# Altium project led panel 0.3.PrjPcb
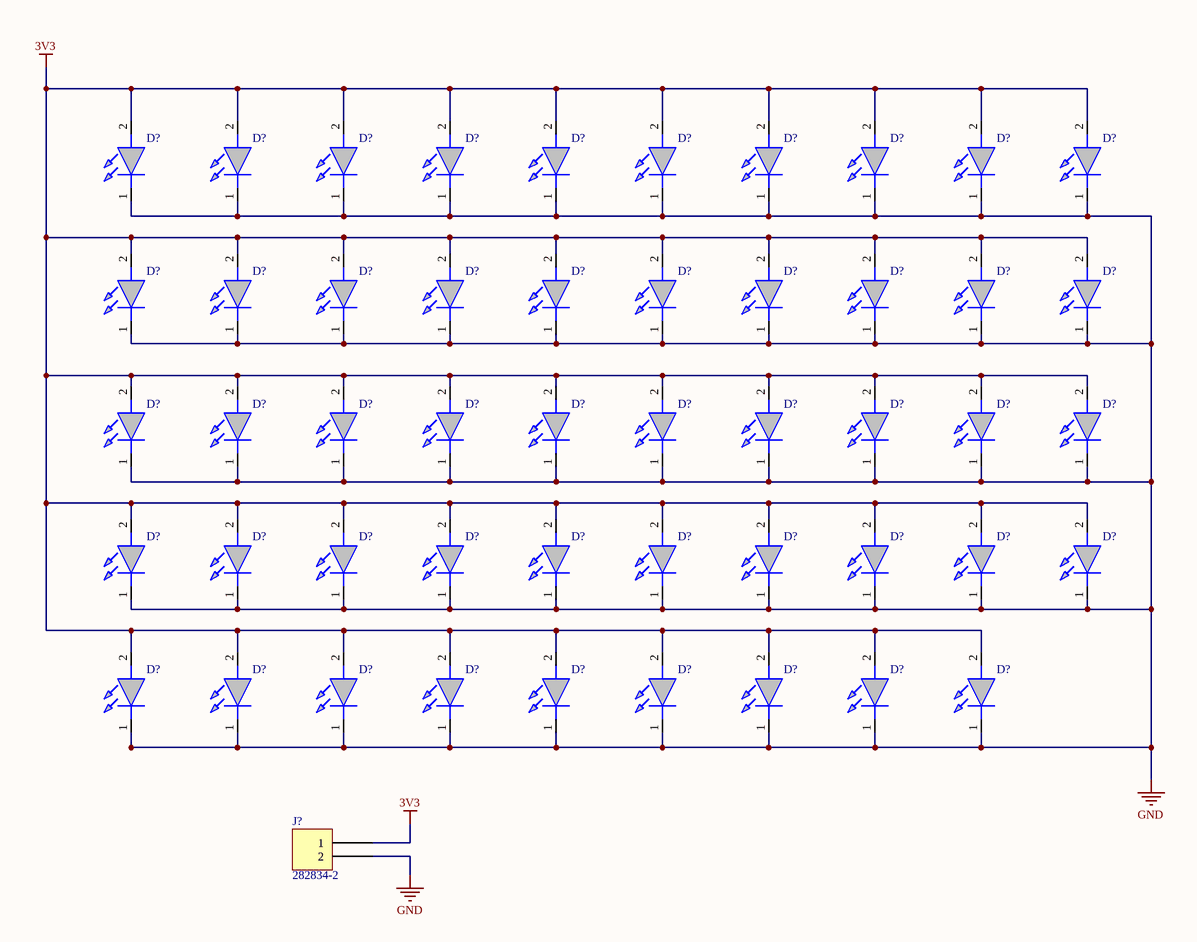
[diagram p0: led panel 0.3.SchDoc]
1 sheet, 50 parts. Net scope: global (net labels, ports and power ports of the same name join across sheets).
Board file: led panel 0.3.PcbDoc

## Sheet led panel 0.3.SchDoc
size D; SheetNumber: 1; SheetTotal: 1

### Parts
(Parts that share a designator on the sheet are numbered #1, #2 ... from top to bottom, then left to right.)
D?#1  L1IG-0750100000000  [L1IG0750100000000]  (value not drawn)
D?#2  L1IG-0750100000000  [L1IG0750100000000]  (value not drawn)
D?#3  L1IG-0750100000000  [L1IG0750100000000]  (value not drawn)
D?#4  L1IG-0750100000000  [L1IG0750100000000]  (value not drawn)
D?#5  L1IG-0750100000000  [L1IG0750100000000]  (value not drawn)
D?#6  L1IG-0750100000000  [L1IG0750100000000]  (value not drawn)
D?#7  L1IG-0750100000000  [L1IG0750100000000]  (value not drawn)
D?#8  L1IG-0750100000000  [L1IG0750100000000]  (value not drawn)
D?#9  L1IG-0750100000000  [L1IG0750100000000]  (value not drawn)
D?#10  L1IG-0750100000000  [L1IG0750100000000]  (value not drawn)
D?#11  L1IG-0750100000000  [L1IG0750100000000]  (value not drawn)
D?#12  L1IG-0750100000000  [L1IG0750100000000]  (value not drawn)
D?#13  L1IG-0750100000000  [L1IG0750100000000]  (value not drawn)
D?#14  L1IG-0750100000000  [L1IG0750100000000]  (value not drawn)
D?#15  L1IG-0750100000000  [L1IG0750100000000]  (value not drawn)
D?#16  L1IG-0750100000000  [L1IG0750100000000]  (value not drawn)
D?#17  L1IG-0750100000000  [L1IG0750100000000]  (value not drawn)
D?#18  L1IG-0750100000000  [L1IG0750100000000]  (value not drawn)
D?#19  L1IG-0750100000000  [L1IG0750100000000]  (value not drawn)
D?#20  L1IG-0750100000000  [L1IG0750100000000]  (value not drawn)
D?#21  L1IG-0750100000000  [L1IG0750100000000]  (value not drawn)
D?#22  L1IG-0750100000000  [L1IG0750100000000]  (value not drawn)
D?#23  L1IG-0750100000000  [L1IG0750100000000]  (value not drawn)
D?#24  L1IG-0750100000000  [L1IG0750100000000]  (value not drawn)
D?#25  L1IG-0750100000000  [L1IG0750100000000]  (value not drawn)
D?#26  L1IG-0750100000000  [L1IG0750100000000]  (value not drawn)
D?#27  L1IG-0750100000000  [L1IG0750100000000]  (value not drawn)
D?#28  L1IG-0750100000000  [L1IG0750100000000]  (value not drawn)
D?#29  L1IG-0750100000000  [L1IG0750100000000]  (value not drawn)
D?#30  L1IG-0750100000000  [L1IG0750100000000]  (value not drawn)
D?#31  L1IG-0750100000000  [L1IG0750100000000]  (value not drawn)
D?#32  L1IG-0750100000000  [L1IG0750100000000]  (value not drawn)
D?#33  L1IG-0750100000000  [L1IG0750100000000]  (value not drawn)
D?#34  L1IG-0750100000000  [L1IG0750100000000]  (value not drawn)
D?#35  L1IG-0750100000000  [L1IG0750100000000]  (value not drawn)
D?#36  L1IG-0750100000000  [L1IG0750100000000]  (value not drawn)
D?#37  L1IG-0750100000000  [L1IG0750100000000]  (value not drawn)
D?#38  L1IG-0750100000000  [L1IG0750100000000]  (value not drawn)
D?#39  L1IG-0750100000000  [L1IG0750100000000]  (value not drawn)
D?#40  L1IG-0750100000000  [L1IG0750100000000]  (value not drawn)
D?#41  L1IG-0750100000000  [L1IG0750100000000]  (value not drawn)
D?#42  L1IG-0750100000000  [L1IG0750100000000]  (value not drawn)
D?#43  L1IG-0750100000000  [L1IG0750100000000]  (value not drawn)
D?#44  L1IG-0750100000000  [L1IG0750100000000]  (value not drawn)
D?#45  L1IG-0750100000000  [L1IG0750100000000]  (value not drawn)
D?#46  L1IG-0750100000000  [L1IG0750100000000]  (value not drawn)
D?#47  L1IG-0750100000000  [L1IG0750100000000]  (value not drawn)
D?#48  L1IG-0750100000000  [L1IG0750100000000]  (value not drawn)
D?#49  L1IG-0750100000000  [L1IG0750100000000]  (value not drawn)
J?  282834-2  [TE 282834-2]

### Nets
3V3: D?#1.2(A) D?#2.2(A) D?#3.2(A) D?#4.2(A) D?#5.2(A) D?#6.2(A) D?#7.2(A) D?#8.2(A) D?#9.2(A) D?#10.2(A) D?#11.2(A) D?#12.2(A) D?#13.2(A) D?#14.2(A) D?#15.2(A) D?#16.2(A) D?#17.2(A) D?#18.2(A) D?#19.2(A) D?#20.2(A) D?#21.2(A) D?#22.2(A) D?#23.2(A) D?#24.2(A) D?#25.2(A) D?#26.2(A) D?#27.2(A) D?#28.2(A) D?#29.2(A) D?#30.2(A) D?#31.2(A) D?#32.2(A) D?#33.2(A) D?#34.2(A) D?#35.2(A) D?#36.2(A) D?#37.2(A) D?#38.2(A) D?#39.2(A) D?#40.2(A) D?#41.2(A) D?#42.2(A) D?#43.2(A) D?#44.2(A) D?#45.2(A) D?#46.2(A) D?#47.2(A) D?#48.2(A) D?#49.2(A) J?.1
GND: D?#1.1(K) D?#2.1(K) D?#3.1(K) D?#4.1(K) D?#5.1(K) D?#6.1(K) D?#7.1(K) D?#8.1(K) D?#9.1(K) D?#10.1(K) D?#11.1(K) D?#12.1(K) D?#13.1(K) D?#14.1(K) D?#15.1(K) D?#16.1(K) D?#17.1(K) D?#18.1(K) D?#19.1(K) D?#20.1(K) D?#21.1(K) D?#22.1(K) D?#23.1(K) D?#24.1(K) D?#25.1(K) D?#26.1(K) D?#27.1(K) D?#28.1(K) D?#29.1(K) D?#30.1(K) D?#31.1(K) D?#32.1(K) D?#33.1(K) D?#34.1(K) D?#35.1(K) D?#36.1(K) D?#37.1(K) D?#38.1(K) D?#39.1(K) D?#40.1(K) D?#41.1(K) D?#42.1(K) D?#43.1(K) D?#44.1(K) D?#45.1(K) D?#46.1(K) D?#47.1(K) D?#48.1(K) D?#49.1(K) J?.2

### Library data of the parts
D?#1-D?#49 = L1IG-0750100000000: Infrared Emitters - High Power Broadrange IR LED 600 - 1050nm; Manufacturer_Name: Lumileds; Mouser Part Number: 997-L1IG075010000; Mouser Price/Stock: https://www.mouser.co.uk/ProductDetail/Lumileds/L1IG-0750100000000?qs=UXgszm6BlbFsaqyaTO4YIQ%3D%3D; Manufacturer_Part_Number: L1IG-0750100000000; Datasheet Link: https://www.lumileds.com/uploads/838/DS263-luxeon-ir-onyx-datasheet-pdf
J? = 282834-2: TERM BLK 2P SIDE ENT 2.54MM PCB; Manufacturer: TE Connectivity AMP Connectors; Current: 10A; Mating Orientation: Horizontal with Board; Number of Levels: 1; Pitch: 0.100" (2.54mm); Positions Per Level: 2; Voltage: 150V; Wire Gauge: 16-30 AWG; Wire Termination: Screw - Rising Cage Clamp; Part Number: 282834-2; Color: Green; ComponentLink1Description: Datasheet; ComponentLink1URL: https://www.te.com/commerce/DocumentDelivery/DDEController?Action=srchrtrv&DocNm=282834&DocType=Customer+Drawing&DocLang=English; ComponentLink2Description: DigiKey Link; ComponentLink2URL: http://digikey.com/product-detail/en/te-connectivity-amp-connectors/282834-2/A98333-ND/1150135; LastUpdated: 1/15/2020 4:15:38 AM; Lifecycle Status: Active; Minimum Order: 1; Mounting Type: Through Hole; Packaging: Bulk; Part Status: Active; Price: 0.88; Series: Buchanan; Supplier 1: DigiKey; Supplier Part Number 1: A98333-ND